# Altium schematic sheet Nucleo.SchDoc
size A4; Author: Audran; CompanyName: Goldorak; Address1: Electrolab; Address2: 52 rue Paul Lescop; Address3: 92000 Nanterre; DocumentNumber: 2; SheetNumber: 2; SheetTotal: 8; ProjectName: Cartes_2017
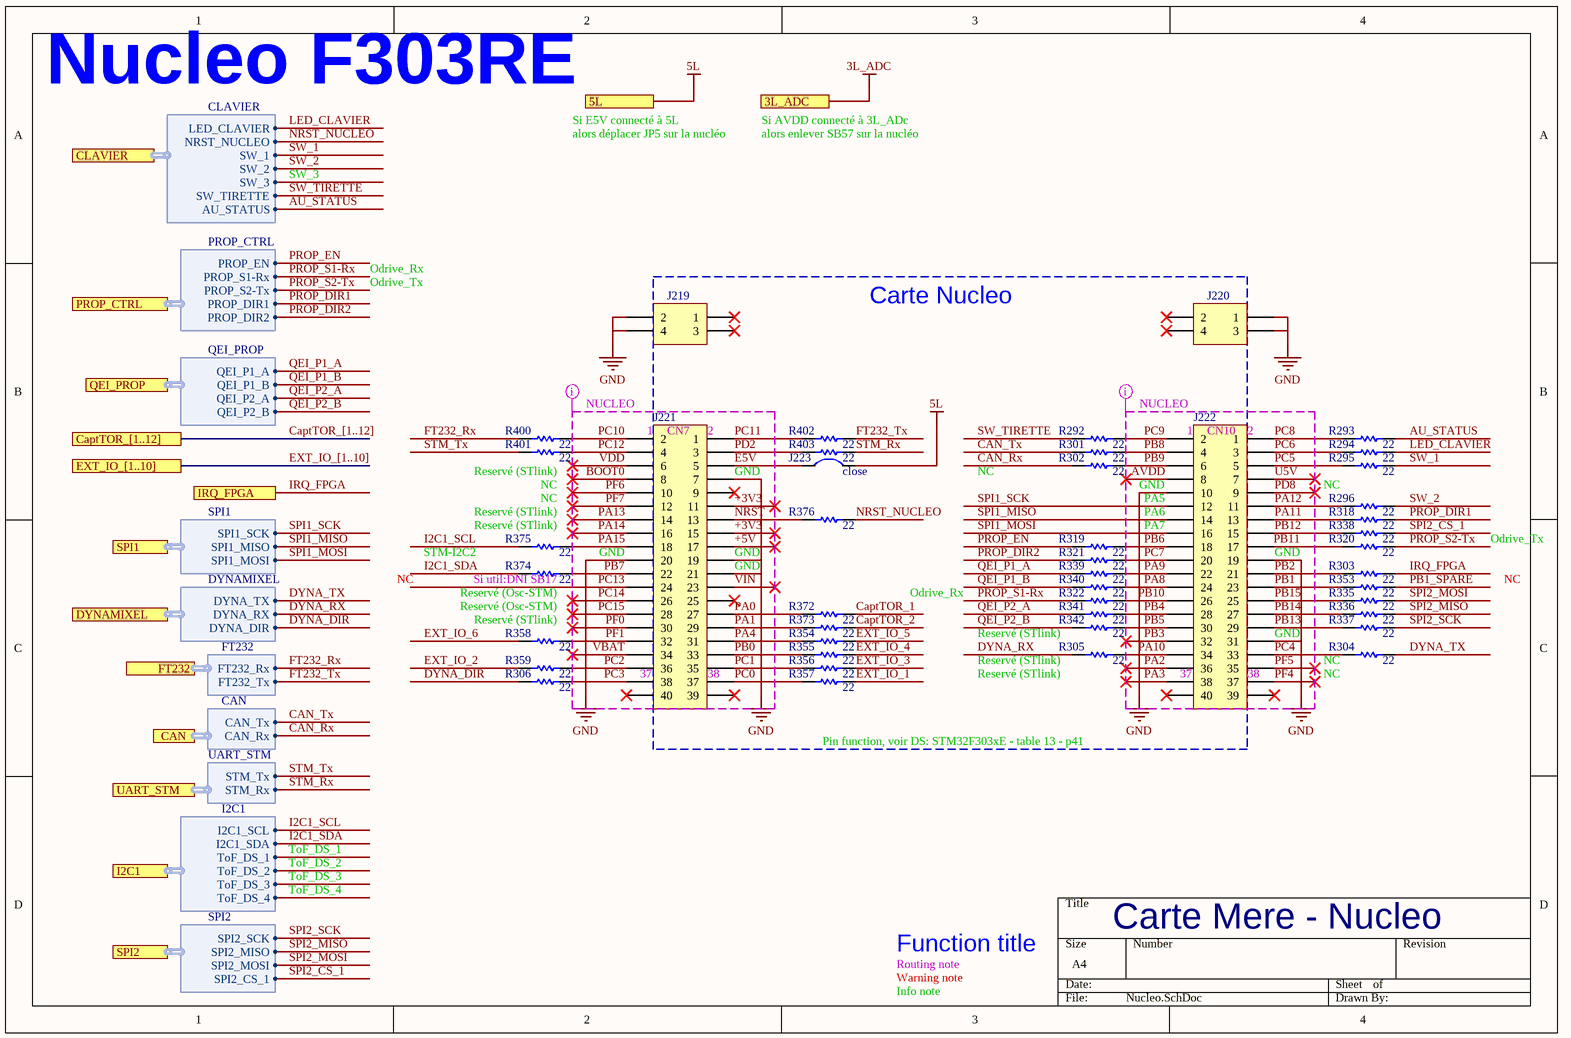
[diagram p0: Nucleo.SchDoc]

## Parts
J219  61000421821  [61000421821]  (value not drawn)
J220  61000421821  [61000421821]  (value not drawn)
J221  61004021821  [61004021821]  (value not drawn)
J222  61004021821  [61004021821]  (value not drawn)
J223  close  [CAVALIER_0603_C]  (net tie, no BOM)
R292  value 22  [RESC1005X04N]  (hidden comment: RC0402FR-0722RL)
R293  value 22  [RESC1005X04N]  (hidden comment: RC0402FR-0722RL)
R294  value 22  [RESC1005X04N]  (hidden comment: RC0402FR-0722RL)
R295  value 22  [RESC1005X04N]  (hidden comment: RC0402FR-0722RL)
R296  value 22  [RESC1005X04N]  (hidden comment: RC0402FR-0722RL)
R301  value 22  [RESC1005X04N]  (hidden comment: RC0402FR-0722RL)
R302  value 22  [RESC1005X04N]  (hidden comment: RC0402FR-0722RL)
R303  value 22  [RESC1005X04N]  (hidden comment: RC0402FR-0722RL)
R304  value 22  [RESC1005X04N]  (hidden comment: RC0402FR-0722RL)
R305  value 22  [RESC1005X04N]  (hidden comment: RC0402FR-0722RL)
R306  value 22  [RESC1005X04N]  (hidden comment: RC0402FR-0722RL)
R318  value 22  [RESC1005X04N]  (hidden comment: RC0402FR-0722RL)
R319  value 22  [RESC1005X04N]  (hidden comment: RC0402FR-0722RL)
R320  value 22  [RESC1005X04N]  (hidden comment: RC0402FR-0722RL)
R321  value 22  [RESC1005X04N]  (hidden comment: RC0402FR-0722RL)
R322  value 22  [RESC1005X04N]  (hidden comment: RC0402FR-0722RL)
R335  value 22  [RESC1005X04N]  (hidden comment: RC0402FR-0722RL)
R336  value 22  [RESC1005X04N]  (hidden comment: RC0402FR-0722RL)
R337  value 22  [RESC1005X04N]  (hidden comment: RC0402FR-0722RL)
R338  value 22  [RESC1005X04N]  (hidden comment: RC0402FR-0722RL)
R339  value 22  [RESC1005X04N]  (hidden comment: RC0402FR-0722RL)
R340  value 22  [RESC1005X04N]  (hidden comment: RC0402FR-0722RL)
R341  value 22  [RESC1005X04N]  (hidden comment: RC0402FR-0722RL)
R342  value 22  [RESC1005X04N]  (hidden comment: RC0402FR-0722RL)
R353  value 22  [RESC1005X04N]  (hidden comment: RC0402FR-0722RL)
R354  value 22  [RESC1005X04N]  (hidden comment: RC0402FR-0722RL)
R355  value 22  [RESC1005X04N]  (hidden comment: RC0402FR-0722RL)
R356  value 22  [RESC1005X04N]  (hidden comment: RC0402FR-0722RL)
R357  value 22  [RESC1005X04N]  (hidden comment: RC0402FR-0722RL)
R358  value 22  [RESC1005X04N]  (hidden comment: RC0402FR-0722RL)
R359  value 22  [RESC1005X04N]  (hidden comment: RC0402FR-0722RL)
R372  value 22  [RESC1005X04N]  (hidden comment: RC0402FR-0722RL)
R373  value 22  [RESC1005X04N]  (hidden comment: RC0402FR-0722RL)
R374  value 22  [RESC1005X04N]  (hidden comment: RC0402FR-0722RL)
R375  value 22  [RESC1005X04N]  (hidden comment: RC0402FR-0722RL)
R376  value 22  [RESC1005X04N]  (hidden comment: RC0402FR-0722RL)
R400  value 22  [RESC1005X04N]  (hidden comment: RC0402FR-0722RL)
R401  value 22  [RESC1005X04N]  (hidden comment: RC0402FR-0722RL)
R402  value 22  [RESC1005X04N]  (hidden comment: RC0402FR-0722RL)
R403  value 22  [RESC1005X04N]  (hidden comment: RC0402FR-0722RL)

## Blocks framed on the sheet
Carte Nucleo: J219-J223 R292 R301 R302 R305 R319 R321 R322 R339-R342 R354-R357 R372 R373 R376 R402 R403

## Ports
3L_ADC, 5L, CAN (harness CAN), CaptTOR_[1..12], CLAVIER (harness CLAVIER), DYNAMIXEL (harness DYNAMIXEL), EXT_IO_[1..10], FT232 (harness FT232), I2C1 (harness I2C1), IRQ_FPGA, PROP_CTRL (harness PROP_CTRL), QEI_PROP (harness QEI_PROP), SPI1 (harness SPI1), SPI2 (harness SPI2), UART_STM (harness UART_STM)

## Harnesses
CLAVIER: LED_CLAVIER, NRST_NUCLEO, SW_1, SW_2, SW_3, SW_TIRETTE, AU_STATUS
PROP_CTRL: PROP_EN, PROP_S1-Rx, PROP_S2-Tx, PROP_DIR1, PROP_DIR2
QEI_PROP: QEI_P1_A, QEI_P1_B, QEI_P2_A, QEI_P2_B
DYNAMIXEL: DYNA_TX, DYNA_RX, DYNA_DIR
FT232: FT232_Tx, FT232_Rx
UART_STM: STM_Tx, STM_Rx
SPI2: SPI2_SCK, SPI2_MISO, SPI2_MOSI, SPI2_CS_1
CAN: CAN_Rx, CAN_Tx
I2C1: I2C1_SCL, I2C1_SDA, ToF_DS_1, ToF_DS_2, ToF_DS_3, ToF_DS_4
SPI1: SPI1_SCK, SPI1_MISO, SPI1_MOSI

## Nets
3L_ADC: port 3L_ADC
5L: J223.2 ; port 5L
GND: J219.2 J219.4 J220.1 J220.3 J221.7 J221.19 J221.20 J221.21 J222.10 J222.19 J222.31
+3V3: J221.11 J221.15
+5V: J221.17
AU_STATUS: R293.2 ; port CLAVIER.AU_STATUS
AVDD: J222.8
BOOT0: J221.8
CAN_Rx: R302.1 ; port CAN.CAN_Rx
CAN_Tx: R301.1 ; port CAN.CAN_Tx
CaptTOR_1: R372.2
CaptTOR_2: R373.2
DYNA_DIR: R306.1 ; port DYNAMIXEL.DYNA_DIR
DYNA_RX: R305.1 ; port DYNAMIXEL.DYNA_RX
DYNA_TX: R304.2 ; port DYNAMIXEL.DYNA_TX
E5V: J221.5 J223.1
EXT_IO_1: R357.2
EXT_IO_2: R359.1
EXT_IO_3: R356.2
EXT_IO_4: R355.2
EXT_IO_5: R354.2
EXT_IO_6: R358.1
FT232_Rx: R400.1 ; port FT232.FT232_Rx
FT232_Tx: R402.2 ; port FT232.FT232_Tx
I2C1_SCL: R375.1 ; port I2C1.I2C1_SCL
I2C1_SDA: R374.1 ; port I2C1.I2C1_SDA
IRQ_FPGA: R303.2 ; port IRQ_FPGA
LED_CLAVIER: R294.2 ; port CLAVIER.LED_CLAVIER
NRST: J221.13 R376.1
NRST_NUCLEO: R376.2 ; port CLAVIER.NRST_NUCLEO
PA0: J221.27 R372.1
PA1: J221.29 R373.1
PA2: J222.36
PA3: J222.38
PA4: J221.31 R354.1
PA8: J222.24 R340.2
PA9: J222.22 R339.2
PA10: J222.34 R305.2
PA11: J222.13 R318.1
PA12: J222.11 R296.1
PA13: J221.14
PA14: J221.16
PA15: J221.18 R375.2
PB0: J221.33 R355.1
PB1: J222.23 R353.1
PB1_SPARE: R353.2
PB2: J222.21 R303.1
PB3: J222.32
PB4: J222.28 R341.2
PB5: J222.30 R342.2
PB6: J222.18 R319.2
PB7: J221.22 R374.2
PB8: J222.4 R301.2
PB9: J222.6 R302.2
PB10: J222.26 R322.2
PB11: J222.17 R320.1
PB12: J222.15 R338.1
PB13: J222.29 R337.1
PB14: J222.27 R336.1
PB15: J222.25 R335.1
PC0: J221.37 R357.1
PC1: J221.35 R356.1
PC2: J221.36 R359.2
PC3: J221.38 R306.2
PC4: J222.33 R304.1
PC5: J222.5 R295.1
PC6: J222.3 R294.1
PC7: J222.20 R321.2
PC8: J222.1 R293.1
PC9: J222.2 R292.2
PC10: J221.2 R400.2
PC11: J221.1 R402.1
PC12: J221.4 R401.2
PC13: J221.24
PC14: J221.26
PC15: J221.28
PD2: J221.3 R403.1
PD8: J222.9
PF0: J221.30
PF1: J221.32 R358.2
PF4: J222.37
PF5: J222.35
PF6: J221.10
PF7: J221.12
PROP_DIR1: R318.2 ; port PROP_CTRL.PROP_DIR1
PROP_DIR2: R321.1 ; port PROP_CTRL.PROP_DIR2
PROP_EN: R319.1 ; port PROP_CTRL.PROP_EN
PROP_S1-Rx: R322.1 ; port PROP_CTRL.PROP_S1-Rx
PROP_S2-Tx: R320.2 ; port PROP_CTRL.PROP_S2-Tx
QEI_P1_A: R339.1 ; port QEI_PROP.QEI_P1_A
QEI_P1_B: R340.1 ; port QEI_PROP.QEI_P1_B
QEI_P2_A: R341.1 ; port QEI_PROP.QEI_P2_A
QEI_P2_B: R342.1 ; port QEI_PROP.QEI_P2_B
SPI1_MISO: J222.14 ; port SPI1.SPI1_MISO
SPI1_MOSI: J222.16 ; port SPI1.SPI1_MOSI
SPI1_SCK: J222.12 ; port SPI1.SPI1_SCK
SPI2_CS_1: R338.2 ; port SPI2.SPI2_CS_1
SPI2_MISO: R336.2 ; port SPI2.SPI2_MISO
SPI2_MOSI: R335.2 ; port SPI2.SPI2_MOSI
SPI2_SCK: R337.2 ; port SPI2.SPI2_SCK
STM_Rx: R403.2 ; port UART_STM.STM_Rx
STM_Tx: R401.1 ; port UART_STM.STM_Tx
SW_1: R295.2 ; port CLAVIER.SW_1
SW_2: R296.2 ; port CLAVIER.SW_2
SW_TIRETTE: R292.1 ; port CLAVIER.SW_TIRETTE
U5V: J222.7
VBAT: J221.34
VDD: J221.6
VIN: J221.23

Not connected (* = marked no-connect by the designer): J219 1* 3*; J220 2* 4*; J221 9* 25* 39* 40*; J222 39* 40*

## Buses and harness runs
bus CaptTOR_[1..12] = port CaptTOR_[1..12]
bus EXT_IO_[1..10] = port EXT_IO_[1..10]

## Layout directives
net class NUCLEO: +3V3, +5V, AVDD, BOOT0, E5V, GND, NRST, PA0, PA1, PA2, PA3, PA4, PA8, PA9, PA10, PA11, PA12, PA13, PA14, PA15, PB0, PB1, PB2, PB3, PB4, PB5, PB6, PB7, PB8, PB9, PB10, PB11, PB12, PB13, PB14, PB15, PC0, PC1, PC2, PC3, PC4, PC5, PC6, PC7, PC8, PC9, PC10, PC11, PC12, PC13, PC14, PC15, PD2, PD8, PF0, PF1, PF4, PF5, PF6, PF7, U5V, VBAT, VDD, VIN

## Notes on the sheet
- Nucleo F303RE
- SW_3
- Si E5V connecté à 5L
- alors déplacer JP5 sur la nucléo
- Si AVDD connecté à 3L_ADc
- alors enlever SB57 sur la nucléo
- Odrive_Tx
- Odrive_Rx
- (near J221) 1
- (near J221) CN7
- (near J221) 2
- (near J222) 1
- (near J222) CN10
- (near J222) 2
- (near R401) Reservé (STlink)
- (near R375) Reservé (STlink)
- NC
- (near J221) GND
- GND
- (near J222) PA5
- (near J222) PA6
- STM-I2C2
- (near R374) Si util:DNI SB17
- PA7
- (near J222) GND
- (near R358) Reservé (STlink)
- Reservé (Osc-STM)
- (near R374) Reservé (Osc-STM)
- Reservé (STlink)
- (near J221) 37
- (near J221) 38
- (near R305) Reservé (STlink)
- (near J222) 37
- (near J222) 38
- (near R304) NC
- Pin function, voir DS: STM32F303xE - table 13 - p41
- ToF_DS_1
- ToF_DS_2
- ToF_DS_3
- ToF_DS_4
- Routing note
- Warning note
- Function title
- Carte Mere - Nucleo
- Info note

## Library data of the parts
J219 J220 = 61000421821: WR-PHD Socket Header, SMT, pitch 2.54mm, Dual Row, Vertical, 4p; Manufacturer: Wurth Elektronik; Value: 4; ComponentLink1Description: Datasheet; ComponentLink1URL: https://www.we-online.com/catalog/datasheet/61000421821.pdf; Manufacturer Part Number: 61000421821; Supplier 1: Farnell; Supplier Part Number 1: 2827865
J221 J222 = 61004021821: WR-PHD Socket Header, SMT, pitch 2.54mm, Dual Row, Vertical, 40p; Manufacturer: Wurth Elektronik; Value: 40; ComponentLink1Description: Datasheet; ComponentLink1URL: https://www.we-online.com/catalog/datasheet/61004021821.pdf; Manufacturer Part Number: 61004021821; Supplier 1: Farnell; Supplier Part Number 1: 2827882
J223 = CAVALIER_0603_C: Cavalier soudure "fermé" + empreinte dipole 0603
R292-R296 R301-R306 R318-R322 R335-R342 R353-R359 R372-R376 R400-R403 = RC0402FR-0722RL: RES SMD 22 OHM 1% 1/16W 0402; Manufacturer: Yageo; Power: 63mW; Vmax: 50V; Type: Thick Film; ComponentLink1Description: Manufacturer; ComponentLink1URL: http://www.yageo.com/NewPortal/_en/index.jsp; ComponentLink2Description: Datasheet; ComponentLink2URL: http://www.farnell.com/datasheets/2167052.pdf; Manufacturer Part Number: RC0402FR-0722RL; Supplier 1: Farnell; Supplier Part Number 1: 9239030; Precision: ±1%; Supplier 2: JLCPCB; Supplier Part Number 2: C25092; Supplier Footprint 2: 0402